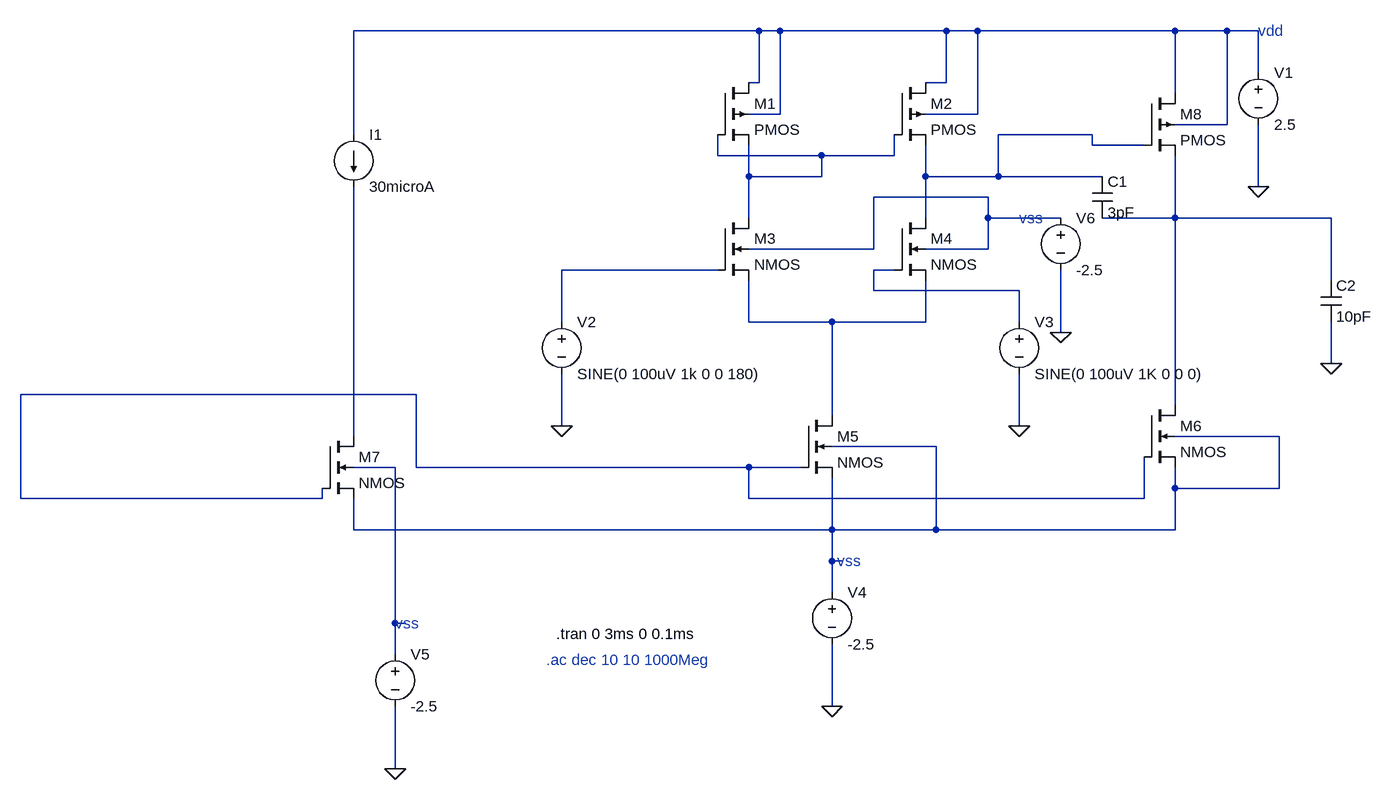
[diagram p0: schematic 2stageopamp crct.asc]
2stageopamp crct.asc, the LTspice schematic file:
Version 4.1
SHEET 1 1712 1140
WIRE 48 -16 -576 -16
WIRE 80 -16 48 -16
WIRE 336 -16 80 -16
WIRE 384 -16 336 -16
WIRE 688 -16 384 -16
WIRE 768 -16 688 -16
WIRE 816 -16 768 -16
WIRE 816 48 816 -16
WIRE 48 64 48 -16
WIRE 48 64 32 64
WIRE 336 64 336 -16
WIRE 336 64 304 64
WIRE 688 80 688 -16
WIRE 80 112 80 -16
WIRE 80 112 32 112
WIRE 384 112 384 -16
WIRE 384 112 304 112
WIRE 768 128 768 -16
WIRE 768 128 688 128
WIRE -576 144 -576 -16
WIRE 560 144 416 144
WIRE 560 160 560 144
WIRE 640 160 560 160
WIRE -16 176 -16 144
WIRE 144 176 -16 176
WIRE 256 176 256 144
WIRE 256 176 144 176
WIRE 32 208 32 160
WIRE 144 208 144 176
WIRE 144 208 32 208
WIRE 304 208 304 160
WIRE 416 208 416 144
WIRE 416 208 304 208
WIRE 576 208 416 208
WIRE 816 224 816 128
WIRE 400 240 224 240
WIRE 32 272 32 208
WIRE 304 272 304 208
WIRE 400 272 400 240
WIRE 512 272 400 272
WIRE 688 272 688 176
WIRE 688 272 576 272
WIRE 928 272 688 272
WIRE 224 320 224 240
WIRE 224 320 32 320
WIRE 400 320 400 272
WIRE 400 320 304 320
WIRE -16 352 -256 352
WIRE 256 352 224 352
WIRE 928 368 928 272
WIRE 224 384 224 352
WIRE 448 384 224 384
WIRE -256 432 -256 352
WIRE 32 432 32 368
WIRE 160 432 32 432
WIRE 304 432 304 368
WIRE 304 432 160 432
WIRE 448 432 448 384
WIRE 512 448 512 352
WIRE 928 496 928 432
WIRE -480 544 -1088 544
WIRE 688 560 688 272
WIRE 160 576 160 432
WIRE -256 592 -256 512
WIRE 448 592 448 512
WIRE -576 608 -576 224
WIRE 848 608 688 608
WIRE 320 624 160 624
WIRE -512 656 -576 656
WIRE -480 656 -480 544
WIRE 32 656 -480 656
WIRE 112 656 32 656
WIRE 688 688 688 656
WIRE 848 688 848 608
WIRE 848 688 688 688
WIRE -1088 704 -1088 544
WIRE -624 704 -624 688
WIRE -624 704 -1088 704
WIRE 32 704 32 656
WIRE 640 704 640 640
WIRE 640 704 32 704
WIRE -576 752 -576 704
WIRE 160 752 160 672
WIRE 160 752 -576 752
WIRE 320 752 320 624
WIRE 320 752 160 752
WIRE 688 752 688 688
WIRE 688 752 320 752
WIRE 160 800 160 752
WIRE 176 800 160 800
WIRE 160 848 160 800
WIRE -512 896 -512 656
WIRE -496 896 -512 896
WIRE -512 944 -512 896
WIRE 160 1024 160 928
WIRE -512 1120 -512 1024
FLAG 928 496 0
FLAG 448 592 0
FLAG -256 592 0
FLAG 160 1024 0
FLAG 816 224 0
FLAG -512 1120 0
FLAG 512 448 0
SYMBOL pmos4 -16 64 R0
SYMATTR InstName M1
SYMBOL pmos4 256 64 R0
SYMATTR InstName M2
SYMBOL nmos4 -16 272 R0
SYMATTR InstName M3
SYMBOL nmos4 256 272 R0
SYMATTR InstName M4
SYMBOL nmos4 112 576 R0
SYMATTR InstName M5
SYMBOL nmos4 640 560 R0
SYMATTR InstName M6
SYMBOL voltage -256 416 R0
WINDOW 123 0 0 Left 0
WINDOW 39 0 0 Left 0
SYMATTR InstName V2
SYMATTR Value SINE(0 100uV 1k 0 0 180)
SYMBOL voltage 448 416 R0
WINDOW 123 0 0 Left 0
WINDOW 39 0 0 Left 0
SYMATTR InstName V3
SYMATTR Value SINE(0 100uV 1K 0 0 0)
SYMBOL current -576 144 R0
SYMATTR InstName I1
SYMATTR Value 30microA
SYMBOL pmos4 640 80 R0
SYMATTR InstName M8
SYMBOL nmos4 -624 608 R0
SYMATTR InstName M7
SYMBOL cap 560 208 R0
SYMATTR InstName C1
SYMATTR Value 3pF
SYMBOL cap 912 368 R0
SYMATTR InstName C2
SYMATTR Value 10pF
SYMBOL voltage 816 32 R0
SYMATTR InstName V1
SYMATTR Value 2.5
SYMBOL voltage 160 832 R0
SYMATTR InstName V4
SYMATTR Value -2.5
SYMBOL voltage -512 928 R0
SYMATTR InstName V5
SYMATTR Value -2.5
SYMBOL voltage 512 256 R0
SYMATTR InstName V6
SYMATTR Value -2.5
TEXT 816 -16 Left 2 ;vdd
TEXT 168 800 Left 2 ;vss
TEXT -512 896 Left 2 ;vss
TEXT 448 272 Left 2 ;vss
TEXT -264 912 Left 2 !.tran 0 3ms 0 0.1ms
TEXT -280 952 Left 2 ;.ac dec 10 10 1000Meg

The netlist it stands for:
* 2stageopamp crct.asc
M1 N001 N003 N003 N001 PMOS
M2 N001 N003 N002 N001 PMOS
M3 N003 N006 N008 N004 NMOS
M4 N002 N007 N008 N004 NMOS
M5 N008 N009 N011 N011 NMOS
M6 N005 N009 N011 N011 NMOS
V2 N006 0 SINE(0 100uV 1k 0 0 180)
V3 N007 0 SINE(0 100uV 1K 0 0 0)
I1 N001 N010 30microA
M8 N001 N002 N005 N001 PMOS
M7 N010 N009 N011 N012 NMOS
C1 N002 N005 3pF
C2 N005 0 10pF
V1 N001 0 2.5
V4 N011 0 -2.5
V5 N012 0 -2.5
V6 N004 0 -2.5
.model NMOS NMOS
.model PMOS PMOS
.lib standard.mos
* vdd
* vss
* vss
* vss
.tran 0 3ms 0 0.1ms
* .ac dec 10 10 1000Meg
.backanno
.end